# EAGLE design 1x4shield (EAGLE 5.10)
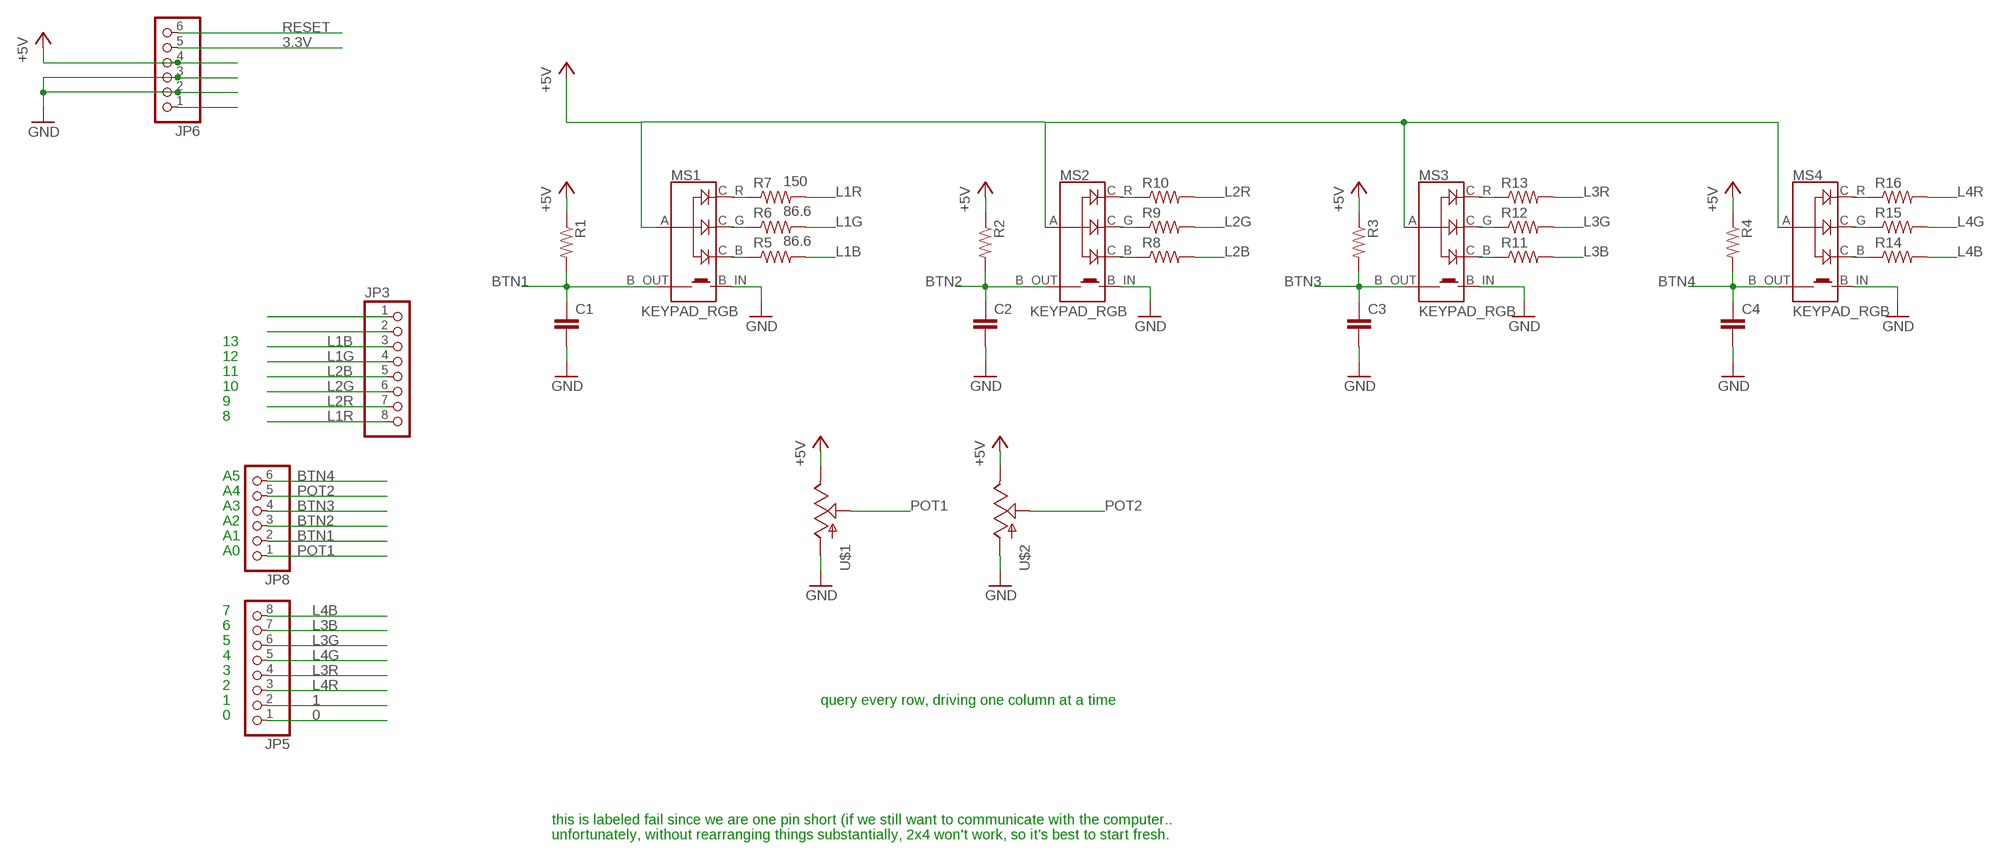
[diagram p0: schematic, sheet 1]

## Parts
C1  CAP0603-CAP  [0603-CAP]
C2  CAP0603-CAP  [0603-CAP]
C3  CAP0603-CAP  [0603-CAP]
C4  CAP0603-CAP  [0603-CAP]
JP3  PINHD-1X8CLEANBIG  [1X08-CLEANBIG]
JP5  PINHD-1X8CLEANBIG  [1X08-CLEANBIG]
JP6  PINHD-1X6CB  [1X06-CLEANBIG]
JP8  PINHD-1X6CB  [1X06-CLEANBIG]
MS1  KEYPAD_RGB  [KEYPAD-RGB]
MS2  KEYPAD_RGB  [KEYPAD-RGB]
MS3  KEYPAD_RGB  [KEYPAD-RGB]
MS4  KEYPAD_RGB  [KEYPAD-RGB]
R1  RESISTOR0603-RES  [0603-RES]
R2  RESISTOR0603-RES  [0603-RES]
R3  RESISTOR0603-RES  [0603-RES]
R4  RESISTOR0603-RES  [0603-RES]
R5  86.6  RESISTOR0603-RES  [0603-RES]
R6  86.6  RESISTOR0603-RES  [0603-RES]
R7  150  RESISTOR0603-RES  [0603-RES]
R8  RESISTOR0603-RES  [0603-RES]
R9  RESISTOR0603-RES  [0603-RES]
R10  RESISTOR0603-RES  [0603-RES]
R11  RESISTOR0603-RES  [0603-RES]
R12  RESISTOR0603-RES  [0603-RES]
R13  RESISTOR0603-RES  [0603-RES]
R14  RESISTOR0603-RES  [0603-RES]
R15  RESISTOR0603-RES  [0603-RES]
R16  RESISTOR0603-RES  [0603-RES]
U$1  POT  [ALPS_POT]
U$2  POT  [ALPS_POT]

## Nets
0: JP5.1
1: JP5.2
3.3V: JP6.5
+5V: JP6.4 MS1.A(ANODE) MS2.A(ANODE) MS3.A(ANODE) MS4.A(ANODE) R1.1 R2.1 R3.1 R4.1 U$1.P$1(E) U$2.P$1(E)
BTN1: C1.1 JP8.2 MS1.B_OUT(BTN_0) R1.2
BTN2: C2.1 JP8.3 MS2.B_OUT(BTN_0) R2.2
BTN3: C3.1 JP8.4 MS3.B_OUT(BTN_0) R3.2
BTN4: C4.1 JP8.6 MS4.B_OUT(BTN_0) R4.2
GND: C1.2 C2.2 C3.2 C4.2 JP6.2 JP6.3 MS1.B_IN(BTN_1) MS2.B_IN(BTN_1) MS3.B_IN(BTN_1) MS4.B_IN(BTN_1) U$1.P$3(A) U$2.P$3(A)
L1B: JP3.3 R5.2
L1G: JP3.4 R6.2
L1R: JP3.8 R7.2
L2B: JP3.5 R8.2
L2G: JP3.6 R9.2
L2R: JP3.7 R10.2
L3B: JP5.7 R11.2
L3G: JP5.6 R12.2
L3R: JP5.4 R13.2
L4B: JP5.8 R14.2
L4G: JP5.5 R15.2
L4R: JP5.3 R16.2
N$1: JP3.2
N$2: MS1.C_R(RED) R7.1
N$3: MS1.C_G(GREEN) R6.1
N$4: MS1.C_B(BLUE) R5.1
N$8: MS2.C_R(RED) R10.1
N$9: MS2.C_G(GREEN) R9.1
N$10: MS2.C_B(BLUE) R8.1
N$14: MS3.C_R(RED) R13.1
N$15: JP6.1
N$16: MS3.C_G(GREEN) R12.1
N$17: MS3.C_B(BLUE) R11.1
N$21: MS4.C_R(RED) R16.1
N$22: MS4.C_G(GREEN) R15.1
N$23: MS4.C_B(BLUE) R14.1
N$153: JP3.1
POT1: JP8.1 U$1.P$2(S)
POT2: JP8.5 U$2.P$2(S)
RESET: JP6.6

## Notes on the sheet
- 13
- 12
- 11
- 10
- 9
- 8
- A5
- A4
- A3
- A2
- A1
- A0
- 7
- 6
- 5
- 4
- 3
- 2
- 1 | query every row, driving one column at a time
- 0
- this is labeled fail since we are one pin short (if we still want to communicate with the computer..
- unfortunately, without rearranging things substantially, 2x4 won't work, so it's best to start fresh.

## Library data of the parts
C1-C4 = SparkFun:CAP: Capacitor Standard 0603 ceramic capacitor, and 0.1" leaded capacitor.
JP3 JP5 = carduino:PINHD-1X8: PIN HEADER
JP6 JP8 = carduino:PINHD-1X6: PIN HEADER
MS1-MS4 = mnm_rgb:KEYPAD_RGB
R1-R16 = SparkFun:RESISTOR: Resistor Basic schematic elements and footprints for 0603, 1206, and PTH 1/10th watt (small) resistors.
U$1 U$2 = SparkFun:POT

## Board
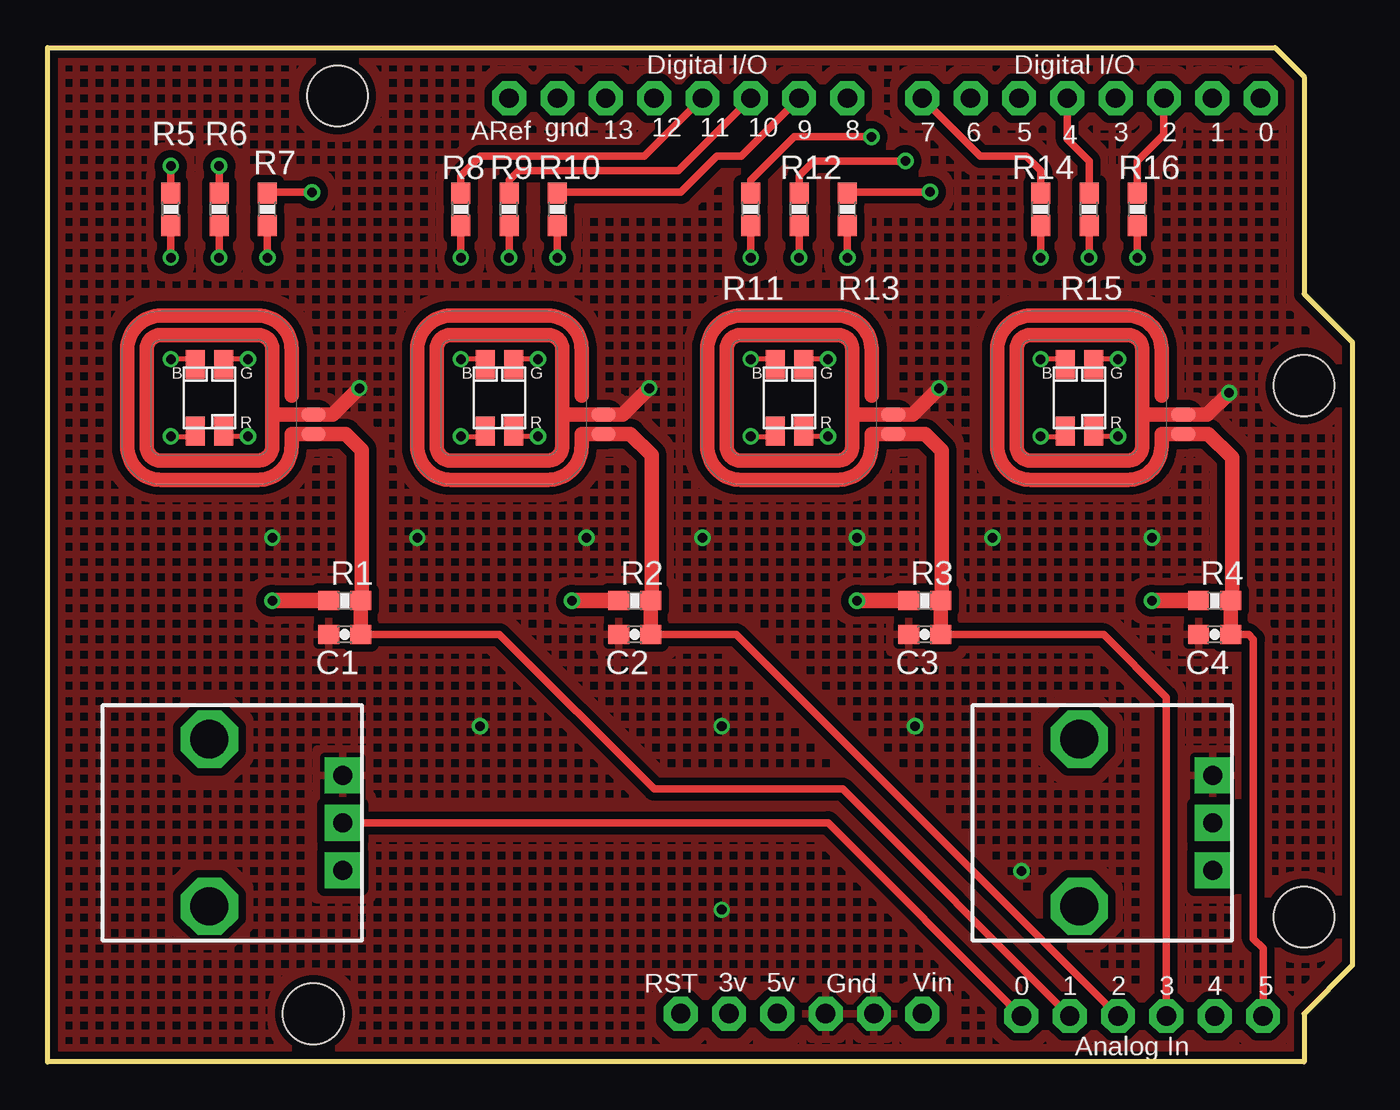
[diagram p1: board, top side]
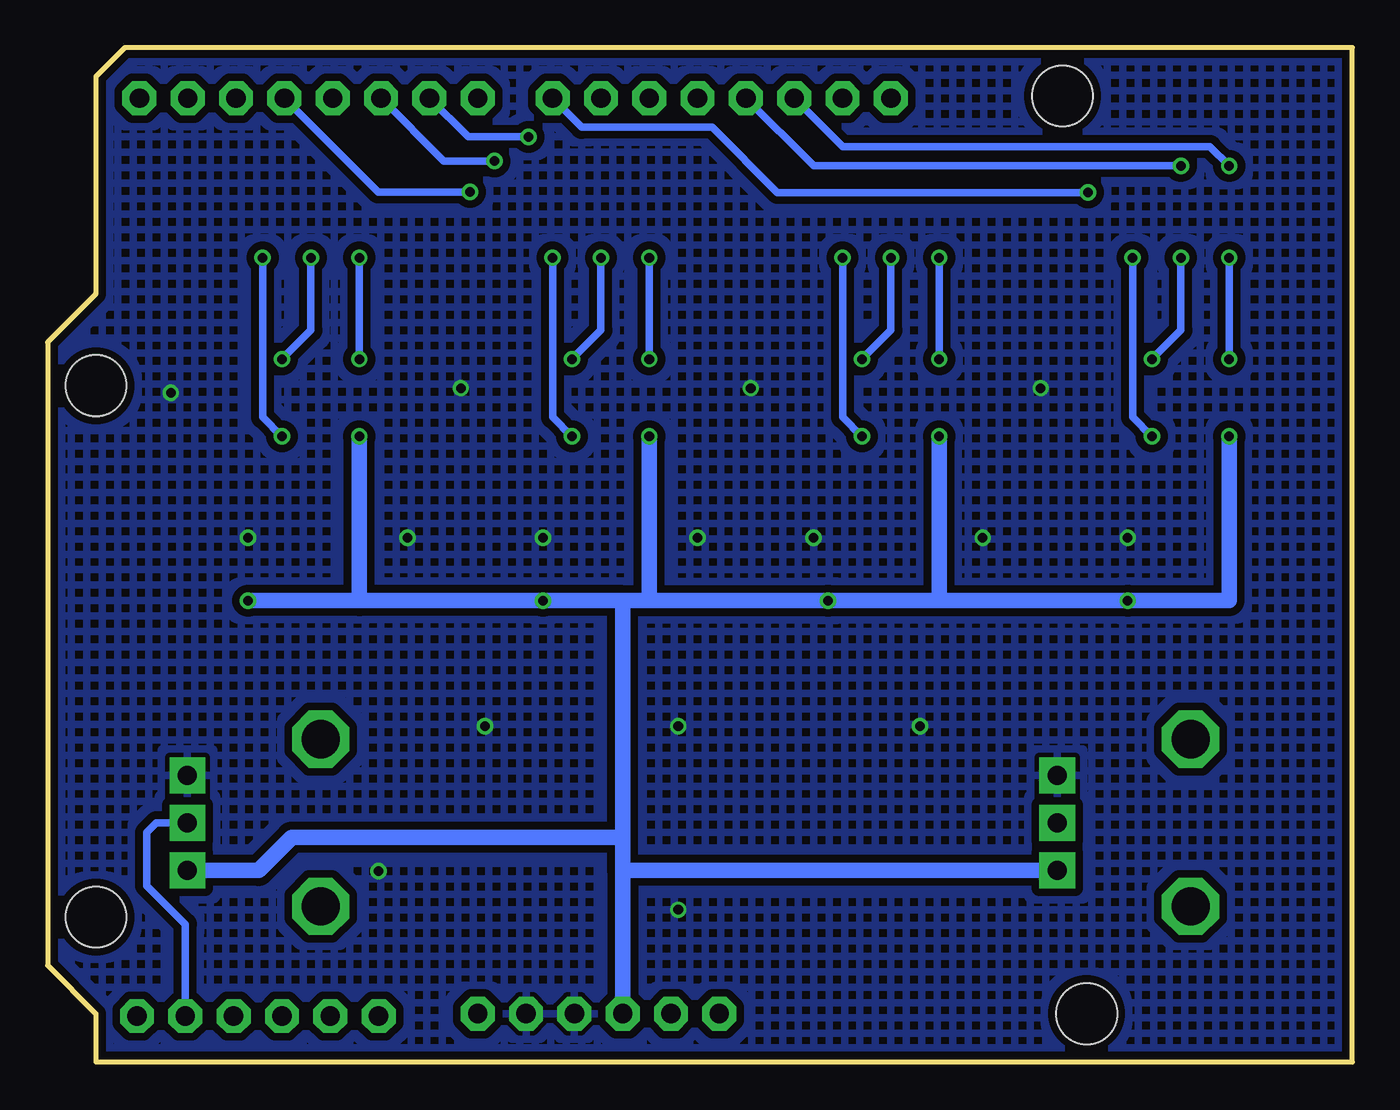
[diagram p2: board, bottom side, seen from below]

Size 68.58 x 53.34 mm. Coordinates in mm from the lower left corner, seen from the top.
Outline: 0,53.34 64.52,53.34 66.04,51.82 66.04,40.39 68.58,37.85 68.58,5.08 66.04,2.54 66.04,0 0,0 0,53.34
Copper layers (1*16): Top 0.0356mm / dielectric 1.5011mm / Bottom 0.0356mm
Design rules "LaenPCBOrder *": minimum track width 6mil, minimum drill 13mil, track to track 6mil, track to pad 6mil, pad to pad 6mil, via to via 6mil, smd to smd 6mil, copper to edge 15mil, drill to drill 6mil, minimum pad ring 7mil, minimum via ring 7mil, stop-mask expansion 4mil, vias tented up to drill 20mil, thermal gap 10mil
Holes 3.2 mm at 66.04,35.56 66.04,7.62 15.24,50.8 13.97,2.54

### Footprints (pad centres in the part's own frame; a part is rotated, then mirrored left to right if it is on the bottom)
0603-CAP = smd 1.1 x 1: 1 -0.85,0; 2 0.85,0
1X08-CLEANBIG = drill 1.016 pad 1.778 octagon: 1 -8.89,0; 2 -6.35,0; 3 -3.81,0; 4 -1.27,0; 5 1.27,0; 6 3.81,0; 7 6.35,0; 8 8.89,0
1X06-CLEANBIG = drill 1.016 pad 1.778 octagon: 1 -6.35,0; 2 -3.81,0; 3 -1.27,0; 4 1.27,0; 5 3.81,0; 6 6.35,0
KEYPAD-RGB = drill 0.5 round: A -2.032,-2.032; C_B -2.032,2.032; C_G 2.032,2.032; C_R 2.032,-2.032 | smd 1 x 1.5: A_SMD -0.75,-1.75; C_B_SMD -0.75,1.75; C_G_SMD 0.75,1.75; C_R_SMD 0.75,-1.75 | smd 1.27 x 0.762: B_IN 5.461,-0.889; B_OUT 5.461,-1.905
0603-RES = smd 1.1 x 1: 1 -0.85,0; 2 0.85,0
ALPS_POT = drill 1 pad 1.88 square: P$1 7,-2.5; P$2 7,0; P$3 7,2.5 | drill 2 octagon: P$4 0,-4.4; P$5 0,4.4

### Placement (x,y rotation side)
C1  15.62,22.48 180 top
C2  30.86,22.48 180 top
C3  46.1,22.48 180 top
C4  61.34,22.48 180 top
JP3  33.15,50.67 0 top
JP5  54.86,50.67 180 top
JP6  39.62,2.54 180 top
JP8  57.53,2.41 0 top
MS1  8.51,34.92 0 top
MS2  23.75,34.92 0 top
MS3  38.99,34.92 0 top
MS4  54.23,34.92 0 top
R1  15.62,24.26 0 top
R2  30.86,24.26 0 top
R3  46.1,24.26 0 top
R4  61.34,24.26 0 top
R5  6.48,44.83 90 top
R6  9.02,44.83 90 top
R7  11.56,44.83 90 top
R8  21.72,44.83 90 top
R9  24.26,44.83 90 top
R10  26.8,44.83 90 top
R11  36.96,44.83 90 top
R12  39.5,44.83 90 top
R13  42.04,44.83 90 top
R14  52.2,44.83 90 top
R15  54.74,44.83 90 top
R16  57.28,44.83 90 top
U$1  8.51,12.57 0 top
U$2  54.23,12.57 0 top

### Tracks (layer width: path | path; a pad name or v marks a point on that pad's centre or on a via)
+5V  (via drill 0.5)
  Top 0.813: v11.81,24.26 R1.1 | v27.56,24.26 R2.1 | v58.04,24.26 R4.1 | v42.54,24.26 R3.1
  Bottom 0.813: U$1.P$1 38.35,10.07 | 38.35,10.07 JP6.4 | U$2.P$1 57.49,10.07 55.75,11.81 38.35,11.81 | 38.35,10.07 38.35,11.81 | 38.35,11.81 38.35,24.26 | 38.35,24.26 36.96,24.26 | 21.72,24.26 v11.81,24.26 6.48,24.26 MS1.A | 52.2,24.26 v42.54,24.26 38.35,24.26 | 52.2,24.26 v58.04,24.26 | 36.96,24.26 MS3.A | 36.96,24.26 v27.56,24.26 21.72,24.26 | 52.2,24.26 MS4.A | 21.72,24.26 MS2.A
BTN1
  Top 0.406: JP8.2 41.78,14.35 31.88,14.35 23.75,22.48 C1.1
  Top 0.762: MS1.B_OUT 15.67,33.02 16.51,32.18 16.51,24.27 R1.2 C1.1
BTN2
  Top 0.406: C2.1 36.2,22.48 JP8.3
  Top 0.762: MS2.B_OUT 30.63,33.02 31.75,31.9 31.75,24.27 R2.2 C2.1
BTN3
  Top 0.406: JP8.4 58.8,19.18 55.5,22.48 C3.1
  Top 0.762: MS3.B_OUT 46.13,33.02 46.99,32.16 46.99,24.27 R3.2 C3.1
BTN4
  Top 0.406: JP8.6 63.88,5.97 63.37,6.48 63.37,22.23 63.12,22.48 C4.1
  Top 0.762: MS4.B_OUT 61.01,33.02 62.25,31.78 62.25,24.27 R4.2 C4.1
GND  (via drill 0.5)
  Top 0.762: MS1.B_IN 14.99,34.04 v16.38,35.43 | MS2.B_IN 30.23,34.04 v31.62,35.43 | MS3.B_IN 45.47,34.04 v46.86,35.43 | MS4.B_IN 60.96,34.04 v62.1,35.18
  other vias: 22.73,17.65 35.43,17.65 45.59,17.65 35.43,8 51.18,10.03 42.54,27.56 58.04,27.56 49.66,27.56 34.42,27.56 28.32,27.56 19.43,27.56 11.81,27.56
  pour Top (isolate 0.406, hatched): 0.38,53.72 70.48,53.72 70.48,-0.89 -0.89,-0.89 -0.89,53.72
  pour Bottom (isolate 0.406, hatched): -0.13,53.47 69.72,53.47 69.72,-0.64 -0.13,-0.64
L1B  (via drill 0.5)
  Top 0.406: R5.2 v6.48,47.12
  Bottom 0.406: v6.48,47.12 7.49,48.13 26.8,48.13 JP3.3
L1G  (via drill 0.5)
  Top 0.406: R6.2 v9.02,47.12
  Bottom 0.406: v9.02,47.12 28.32,47.12 JP3.4
L1R  (via drill 0.5)
  Top 0.406: v13.89,45.72 v13.88,45.73 11.61,45.73 R7.2
  Bottom 0.406: v13.89,45.72 30.23,45.72 33.65,49.15 40.51,49.15 JP3.8
L2B
  Top 0.406: R8.2 21.72,46.61 22.73,47.62 31.37,47.62 JP3.5
L2G
  Top 0.406: R9.2 24.26,46.35 24.77,46.86 33.15,46.86 JP3.6
L2R
  Top 0.406: JP3.7 36.45,47.62 35.18,47.62 33.28,45.73 26.85,45.73 R10.2
L3B  (via drill 0.5)
  Top 0.406: R11.2 36.96,46.35 39.24,48.64 v43.31,48.64
  Bottom 0.406: v43.31,48.64 46.48,48.64 JP5.7
L3G  (via drill 0.5)
  Top 0.406: R12.2 39.5,46.61 40.26,47.37 v45.09,47.37
  Bottom 0.406: v45.09,47.37 47.75,47.37 JP5.6
L3R  (via drill 0.5)
  Top 0.406: v46.38,45.74 46.37,45.73 42.09,45.73 R13.2
  Bottom 0.406: v46.38,45.74 51.21,45.74 JP5.4
L4B
  Top 0.406: R14.2 52.2,46.86 51.43,47.62 49.02,47.62 JP5.8
L4G
  Top 0.406: JP5.5 53.59,48.51 54.74,47.37 R15.2
L4R
  Top 0.406: JP5.3 58.67,48.77 57.28,47.37 R16.2
N$2  (via drill 0.5)
  Top 0.406: v11.56,42.29 R7.1
  Bottom 0.406: v11.56,42.29 11.56,33.91 MS1.C_R
N$3  (via drill 0.5)
  Top 0.406: v9.02,42.29 R6.1
  Bottom 0.406: v9.02,42.29 9.02,38.48 MS1.C_G
N$4  (via drill 0.5)
  Top 0.406: v6.48,42.29 R5.1
  Bottom 0.406: MS1.C_B v6.48,42.29
N$8  (via drill 0.5)
  Top 0.406: v26.8,42.29 R10.1
  Bottom 0.406: v26.8,42.29 26.8,33.91 MS2.C_R
N$9  (via drill 0.5)
  Top 0.406: v24.26,42.29 R9.1
  Bottom 0.406: v24.26,42.29 24.26,38.48 MS2.C_G
N$10  (via drill 0.5)
  Top 0.406: v21.72,42.29 R8.1
  Bottom 0.406: MS2.C_B v21.72,42.29
N$14  (via drill 0.5)
  Top 0.406: v42.04,42.29 R13.1
  Bottom 0.406: v42.04,42.29 42.04,33.91 MS3.C_R
N$16  (via drill 0.5)
  Top 0.406: v39.5,42.29 R12.1
  Bottom 0.406: v39.5,42.29 39.5,38.48 MS3.C_G
N$17  (via drill 0.5)
  Top 0.406: v36.96,42.29 R11.1
  Bottom 0.406: MS3.C_B v36.96,42.29
N$21  (via drill 0.5)
  Top 0.406: v57.28,42.29 R16.1
  Bottom 0.406: v57.28,42.29 57.28,33.91 MS4.C_R
N$22  (via drill 0.5)
  Top 0.406: v54.74,42.29 R15.1
  Bottom 0.406: v54.74,42.29 54.74,38.48 MS4.C_G
N$23  (via drill 0.5)
  Top 0.406: v52.2,42.29 R14.1
  Bottom 0.406: MS4.C_B v52.2,42.29
POT1
  Top 0.406: U$1.P$2 41.02,12.57 JP8.1
POT2
  Bottom 0.406: U$2.P$2 62.86,12.57 63.37,12.06 63.37,9.27 61.34,7.24 JP8.5

### Text on the board
tPlace: Digital I/O | Digital I/O | ARef | gnd | 13 | 12 | 11 | 10 | 9 | 8 | 7 | 6 | 5 | 3 | 2 | 1 | 0 | 4 | RST | 3v | 5v | Vin | Gnd | 0 | 1 | 2 | 3 | 4 | 5 | Analog In